# Altium schematic sheet DAC.SchDoc
size A
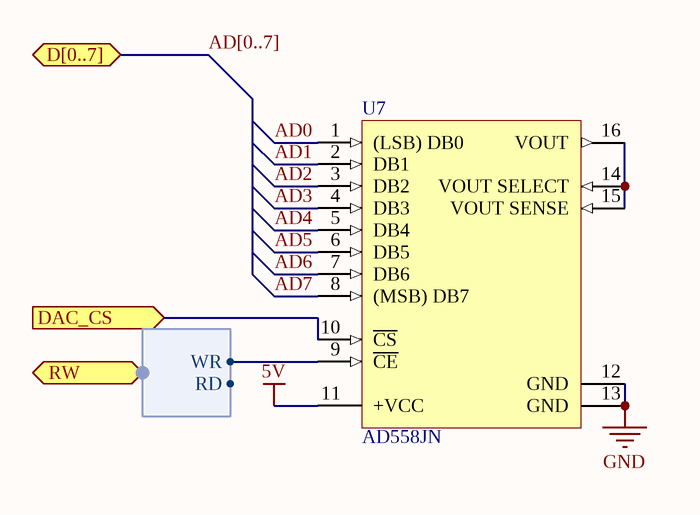
[diagram p0: DAC.SchDoc]

## Parts
U7  AD558JN  [N-16]

## Ports
D[0..7] (bidir), DAC_CS (in), RW (harness RW)

## Harnesses
RW: WR, RD

## Nets
5V: U7.11(+VCC)
GND: U7.12(GND) U7.13(GND)
AD0: U7.1((LSB)_DB0)
AD1: U7.2(DB1)
AD2: U7.3(DB2)
AD3: U7.4(DB3)
AD4: U7.5(DB4)
AD5: U7.6(DB5)
AD6: U7.7(DB6)
AD7: U7.8((MSB)_DB7)
DAC_CS: U7.10(~{CS}) ; port DAC_CS
NetU7_9: U7.9(~{CE}) ; port RW.WR
NetU7_14: U7.14(VOUT_SELECT) U7.15(VOUT_SENSE) U7.16(VOUT)

## Buses and harness runs
bus AD[0..7] = port D[0..7]

## Library data of the parts
U7 = CMP-0318-00222-2: Single 8-Bit Low Cost Complete uP-Compatible DACPORT, 0 to +70 degC, N-16, Tube; Generic Part Number: AD558; Manufacturer: Analog Devices; Settling Time: 800ns; Max V+: 16.5V; Resolution (Bits): 8; Op Pwr Diss: 375mW; # DAC Outputs: 1; Single Supply: Yes; Code_JEDEC: MS-001; ComponentLink1URL: http://www.analog.com/en/index.html; RevisionNote: Component URL fixed; PackageDescription: 16-Lead Plastic Dual In-Line Package [PDIP] Narrow Body; PackageReference: N-16; ComponentLink3URL: http://www.analog.com/static/imported-files/packages/44768431550332N_16.pdf; ComponentLink2Description: Datasheet; Packing: Tube; RoHS: N; Mounting Technology: Through Hole; PackageVersion: 070706-A; ComponentLink2URL: http://www.analog.com/static/imported-files/data_sheets/AD558.pdf; DatasheetVersion: Rev.A; PartNumber: AD558JN; ComponentLink4URL: http://www.analog.com/en/digital-to-analog-converters/da-converters/ad558/products/product.html; ComponentLink1Description: Manufacturer URL; ComponentLink4Description: Product URL; ComponentLink3Description: Package Specification